# Altium project Nano.PrjPcb
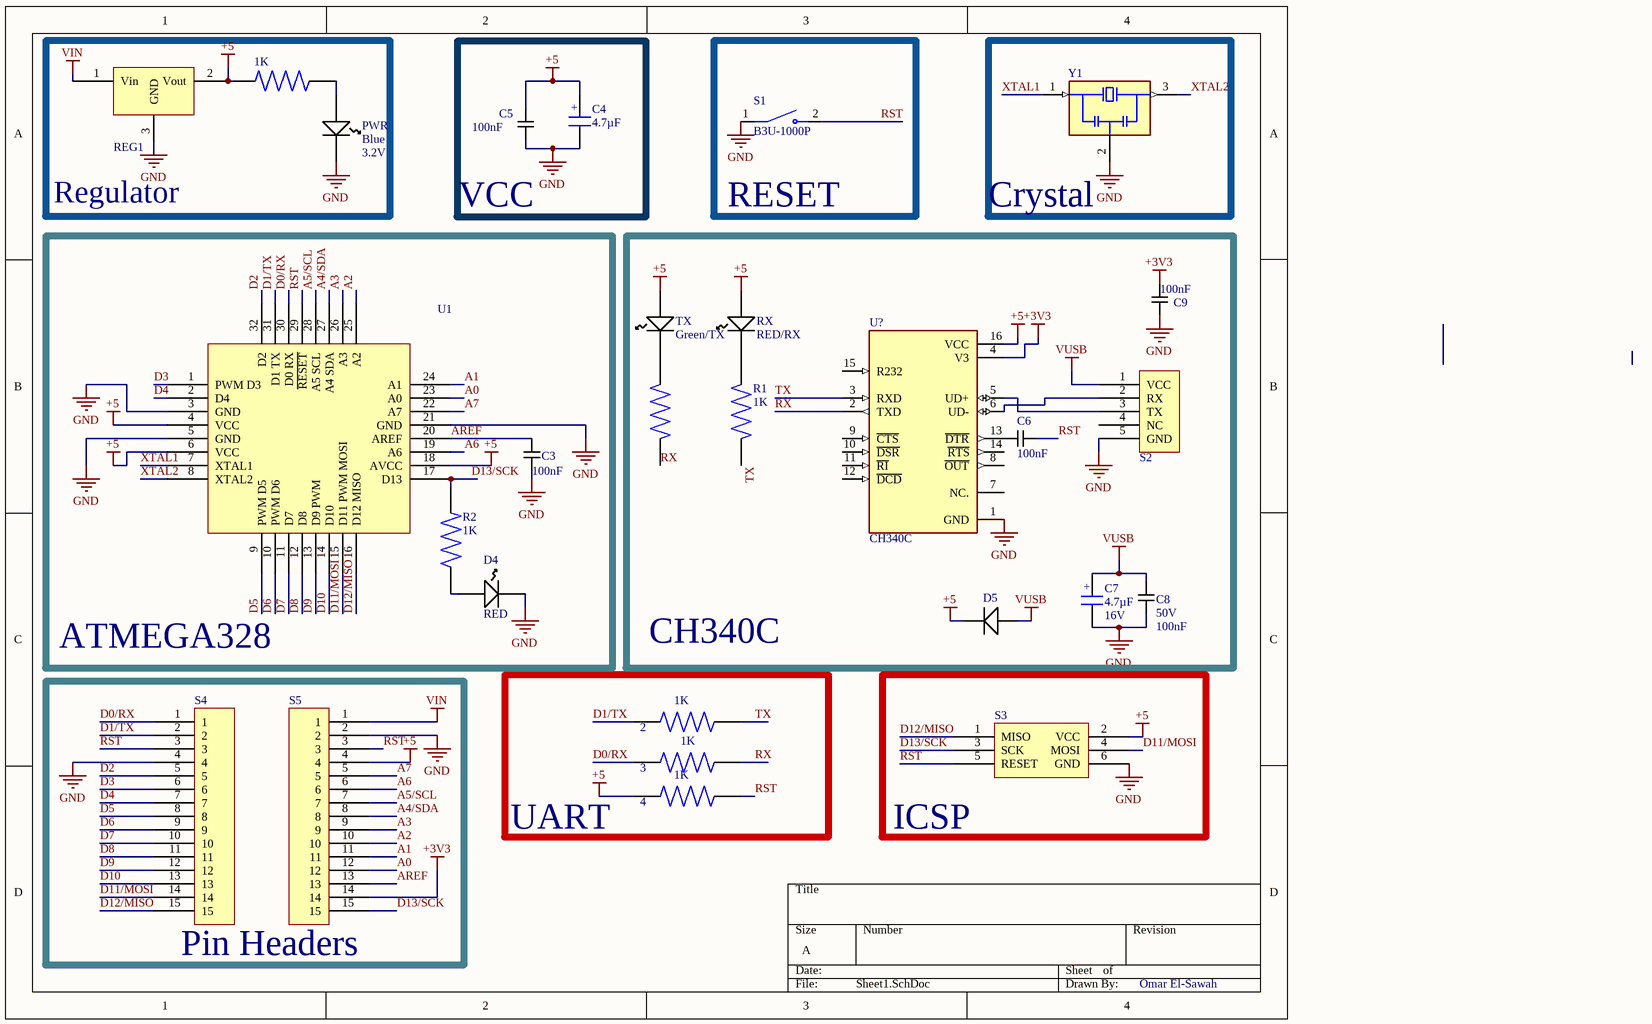
[diagram p0: Sheet1.SchDoc]
Designer: Omar El-Sawah
1 sheet, 28 parts. Net scope: global (net labels, ports and power ports of the same name join across sheets).
Board file: NANO PCB.PcbDoc

## Sheet Sheet1.SchDoc
size A; SheetNumber: 1; SheetTotal: 1

### Parts
1K  ERA3AEB8870V  [RES_ERA3AEB8870V]  (value not drawn)
2  1K  [RES_ERA3AEB8870V]
3  1K  [RES_ERA3AEB8870V]
4  1K  [RES_ERA3AEB8870V]
C3  Capacitance: 100nF  [CAPCP2012X09N]  (hidden comment: 100nF Ceramic Multilayer Capacitor_1)
C4  value 4.7µF  [CASE A - 3216X18]  (hidden comment: Capacitor SMT Tantalum)
C5  Capacitance: 100nF  [CAPCP2012X09N]  (hidden comment: 100nF Ceramic Multilayer Capacitor_1)
C6  Capacitance: 100nF  [CAPCP2012X09N]  (hidden comment: 100nF Ceramic Multilayer Capacitor_1)
C7  value 4.7µF  Voltage: 16V  [CASE A - 3216X18]  (hidden comment: Capacitor SMT Tantalum)
C8  Voltage: 50V  Capacitance: 100nF  [CAPCP2012X09N]  (hidden comment: 100nF Ceramic Multilayer Capacitor_1)
C9  Capacitance: 100nF  [CAPCP2012X09N]  (hidden comment: 100nF Ceramic Multilayer Capacitor_1)
D4  Color: RED  [LED1913X12NRED]  (hidden comment: L)
D5  Panasonic DB2J20900L Schottky Diode, 0.5A, 20V, 2.4ns, 2-Pin SMini2 F5 B  [DIOM1712X07N]  (value not drawn)
PWR  Color: Blue  Forward Voltage: 3.2V  [LED1913X12NBLUE]  (hidden comment: Kingbright Blue LED, 60 mcd 120 ° 0805)
R1  1K  [RES_ERA3AEB8870V]
R2  1K  [RES_ERA3AEB8870V]
REG1  LM1117MP-5.0/NOPB, Low Dropout Voltage Regulator, 1.5A, 5 V ±1%, 4-Pin SOT-223  [SOT230P700X180-4N]  (value not drawn)
RX  Color: RED/RX  [LED1913X12NRED]  (hidden comment: Kingbright Red LED, 100 mcd 120 ° 0805)
S1  B3U-1000P  [SW_B3U-1000P]
S2  NewMolex Right Angle SMT Female Type B Micro USB Connector, 30 V ac, 1.8A  [MicroUSB]  (value not drawn)
S3  Programming Headers Dual Row  [ISP HEADER]  (value not drawn)
S4  connector;str header;single row;.1 cont centers;.095 tail;gold or gtx;36 contact  [Header]  (value not drawn)
S5  connector;str header;single row;.1 cont centers;.095 tail;gold or gtx;36 contact  [Header]  (value not drawn)
TX  Color: Green/TX  [LED1913X12NGREEN]  (hidden comment: Kingbright Green LED, 70 mcd 120 ° 0805)
U1  ATMEGA328  [TQFP80P900X900X120-32N]
U?  CH340C  [SOIC127P600X180-16N]
Y1  CSTCE16M3V53-R0  [OSC_CSTCE16M3V53-R0]  (value not drawn)
  ERA3AEB8870V  [RES_ERA3AEB8870V]  (value not drawn)

### Blocks framed on the sheet
Regulator: 1K PWR REG1
VCC: C4 C5
RESET: S1
Crystal: Y1
CH340C: C6-C9 D5 R1 RX S2 TX U? 
Pin Headers: S4 S5
UART: 2-4
ICSP: S3

### Nets
+3V3: C9.2 S5.14 U?.4(V3)
+5: 1K.2 4.1 C4.1 C5.2 D5.1 REG1.2(Vout) RX.1(A) S3.2(VCC) S5.4 TX.1(A) U1.4(VCC) U1.6(VCC) U1.18(AVCC) U?.16(VCC)
GND: C3.2 C4.2 C5.1 C7.2 C8.2 C9.1 D4.2(K) PWR.2(K) REG1.3(GND) S1.1 S2.5(GND) S3.6(GND) S4.4 S5.2 U1.3(GND) U1.5(GND) U1.21(GND) U?.1(GND) Y1.2(GND)
VIN: REG1.1(Vin) S5.1
VUSB: C7.1 C8.1 D5.2 S2.1(VCC)
A0: S5.12 U1.23(A0)
A1: S5.11 U1.24(A1)
A2: S5.10 U1.25(A2)
A3: S5.9 U1.26(A3)
A4/SDA: S5.8 U1.27(A4_SDA)
A5/SCL: S5.7 U1.28(A5_SCL)
A6: S5.6 U1.19(A6)
A7: S5.5 U1.22(A7)
AREF: C3.1 S5.13 U1.20(AREF)
D0/RX: 3.1 S4.1 U1.30(D0_RX)
D1/TX: 2.1 S4.2 U1.31(D1_TX)
D2: S4.5 U1.32(D2)
D3: S4.6 U1.1(PWM_D3)
D4: S4.7 U1.2(D4)
D5: S4.8 U1.9(PWM_D5)
D6: S4.9 U1.10(PWM_D6)
D7: S4.10 U1.11(D7)
D8: S4.11 U1.12(D8)
D9: S4.12 U1.13(D9_PWM)
D10: S4.13 U1.14(D10)
D11/MOSI: S3.4(MOSI) S4.14 U1.15(D11_PWM_MOSI)
D12/MISO: S3.1(MISO) S4.15 U1.16(D12_MISO)
D13/SCK: R2.2 S3.3(SCK) S5.15 U1.17(D13)
RST: 4.2 C6.1 S1.2 S3.5(RESET) S4.3 S5.3 U1.29(~{RESET})
RX: 3.2 U?.2(TXD) .2
TX: 2.2 R1.1 U?.3(RXD)
XTAL1: U1.7(XTAL1) Y1.1(IN)
XTAL2: U1.8(XTAL2) Y1.3(OUT)
Net1K_1: 1K.1 PWR.1(A)
NetC6_2: C6.2 U?.13(~{DTR})
NetD4_1: D4.1(A) R2.1
NetR1_2: R1.2 RX.2(K)
NetS2_2: S2.2(RX) U?.6(UD-)
NetS2_3: S2.3(TX) U?.5(UD+)
NetTX_2: TX.2(K) .1

Not connected (* = marked no-connect by the designer): S2 4(NC); U? 7(NC.) 8(~{OUT}) 9(~{CTS}) 10(~{DSR}) 11(~{RI}) 12(~{DCD}) 14(~{RTS}) 15(R232)

### Notes on the sheet
- (in symbol 4.7µF Tant RS 496-3545) +

### Library data of the parts
2-4 R1 R2 = ERA3AEB8870V: Price: None; Package: None; Availability: Unavailable; MP: ERA3AEB8870V; Value: *
C3 C5 C6 C9 = 100nF Ceramic Multilayer Capacitor_1: AVX 0805 Standard 100nF Ceramic Multilayer Capacitor, 50 V dc X7R Dielectric ±10% SMD; Voltage: 50V; Creator: Ritesh Kanjee; Date Created: 18 February 2015; Package: 0805; Manufacturer: AVX; RS Stock No.: 464-6688; Datasheet URL: http://za.rs-online.com/web/p/ceramic-multilayer-capacitors/4646688/
C4 C7 = 4.7µF Tant RS 496-3545: Capacitor,tantalum,SMT,16V,4.7uF,10%,A-case; Part Originator: H Theron; RS Stock Nr.: 496-3545; Tolerance: 10%; Package: 3216-18; Publisher: DPSS; LatestRevisionDate: 28-April-2010; ComponentLink1Description: Supplier Website; ComponentLink1URL: http://za.rs-online.com/web/search/searchBrowseAction.html?method=getProduct&R=4963545; ComponentLink2Description: RS Data sheet; ComponentLink2URL: http://docs-europe.origin.electrocomponents.com/webdocs/04ed/0900766b804ed4cc.pdf
  C4: Voltage: 16V
C8 = 100nF Ceramic Multilayer Capacitor_1: AVX 0805 Standard 100nF Ceramic Multilayer Capacitor, 50 V dc X7R Dielectric ±10% SMD; Creator: Ritesh Kanjee; Date Created: 18 February 2015; Package: 0805; Manufacturer: AVX; RS Stock No.: 464-6688; Datasheet URL: http://za.rs-online.com/web/p/ceramic-multilayer-capacitors/4646688/
D4 RX = Kingbright Red LED, 100 mcd 120 ° 0805: Manufacturer Part No.: KP-2012SRC-PRV; Forward Voltage: 1.85V; Creator: Ritesh Kanjee; Date Created: 18 February 2015; Manufacturer: KingBright; RS Stock No.: 466-3813; Datasheet URL: http://za.rs-online.com/web/p/visible-leds/4663813/
D5 = Schottky Diode, 0.5A, 20V, 2.4ns, 2-Pin SMini2 F5 B: Created By: R Kanjee; Date Created: 1 March 2015; Manufacturer: Panasonic; RS Stock No.: 713-2703; Manufacturer Part No.: DB2J20900L; Datasheet: http://docs-europe.electrocomponents.com/webdocs/1398/0900766b813986b3.pdf; Maximum Continuous Forward Current: 0.5A; Peak Reverse Repetitive Voltage: 20V
PWR = Kingbright Blue LED, 60 mcd 120 ° 0805: Manufacturer Part No.: KP-2012PBC-A; Creator: Ritesh Kanjee; Date Created: 18 February 2015; Manufacturer: KingBright; RS Stock No.: 466-3784; Datasheet URL: http://za.rs-online.com/web/p/visible-leds/4663784/
REG1 = LM1117MP-5.0: Manufacturer: Texas Instruments; Supply Current: 1.5Amps; Output Voltage: 5V; Maximum Input Voltage: 15V; Date Created: 26 February 2015; Created By: R Kanjee; RS Stock No.: 533-9583; Datasheet URL: http://za.rs-online.com/web/p/low-dropout-voltage-regulators/5339583/
S1 = B3U-1000P: Switch Tactile N.O. SPST Round Button Gull Wing 0.05A 12VDC 1.5N SMD Embossed T/R; Price: None; MP: B3U-1000P; Availability: Unavailable; Value: *; Package: None
S2 = Micro USB Connector, 30 V ac, 1.8A: Manufacturer: Molex; Manufacturer Part No.: 105017-0001; Max Voltage: 30V; Creator: R Kanjee; Date Created: 28 February 2015; Datasheet URL: http://za.rs-online.com/web/p/micro-usb-connectors/8486764/; Max Current: 1.8A; RS Stock No: 848-6764
S3 = Programming ISP, Programming Headers Dual Row: Manufacturer: FCI; Manufacturer Part No.: 68000-236HLF; Current Rating: 3Amps Continuous; Created By: R Kanjee; Date Created: 1 March 2015; RS Stock No.: 2509565626
S4 S5 = Single row; PCB headers: Manufacturer: FCI; Manufacturer Part No.: 68000-236HLF; Current Rating: 3Amps Continuous; Created By: R Kanjee; Date Created: 1 March 2015; RS Stock No.: 2509565626
TX = Kingbright Green LED, 70 mcd 120 ° 0805: Manufacturer Part No.: KP-2012MGC; Forward Voltage: 2.1 V; Creator: Ritesh Kanjee; Date Created: 18 February 2015; Manufacturer: KingBright; RS Stock No.: 466-3778; Datasheet URL: http://za.rs-online.com/web/p/visible-leds/4663778/
U1 = ATMEGA328P-AU: ATMEGA328P-AU, 8 bit AVR Microcontroller 20MHz 1 kB, 32 kB Flash, 2 kB RAM, I2C 32-Pin TQFP; Company: Lumina Inova; Created By: Ritesh Kanjee; Date Created: 14 February 2015; RS Stock No.: 696-3092; Datasheet URL: http://docs-europe.electrocomponents.com/webdocs/0db4/0900766b80db4deb.pdf
U? = CH340C: USB to serial chip CH340; MF: WCH; Price: None; Availability: Not in stock; MP: CH340C; Package: None; SnapEDA_Link: https://www.snapeda.com/parts/CH340C/WCH/view-part/?ref=snap; Check_prices: https://www.snapeda.com/parts/CH340C/WCH/view-part/?ref=eda; Value: *
Y1 = CSTCE16M3V53-R0: Resonators RECOMMENDED ALT 81-CSTNE16M3V530000R; MF: Murata; SnapEDA_Link: https://www.snapeda.com/parts/CSTCE16M3V53-R0/Murata/view-part/?ref=snap; Package: SMD-3 Murata; Value: *; MP: CSTCE16M3V53-R0; Check_prices: https://www.snapeda.com/parts/CSTCE16M3V53-R0/Murata/view-part/?ref=eda
1K ? = ERA3AEB8870V: Price: None; Package: None; Availability: Unavailable; MP: ERA3AEB8870V; Value: *